# EAGLE design Adafruit-BeagleBone-ProtoBoard-v0.1 (EAGLE 5.12)
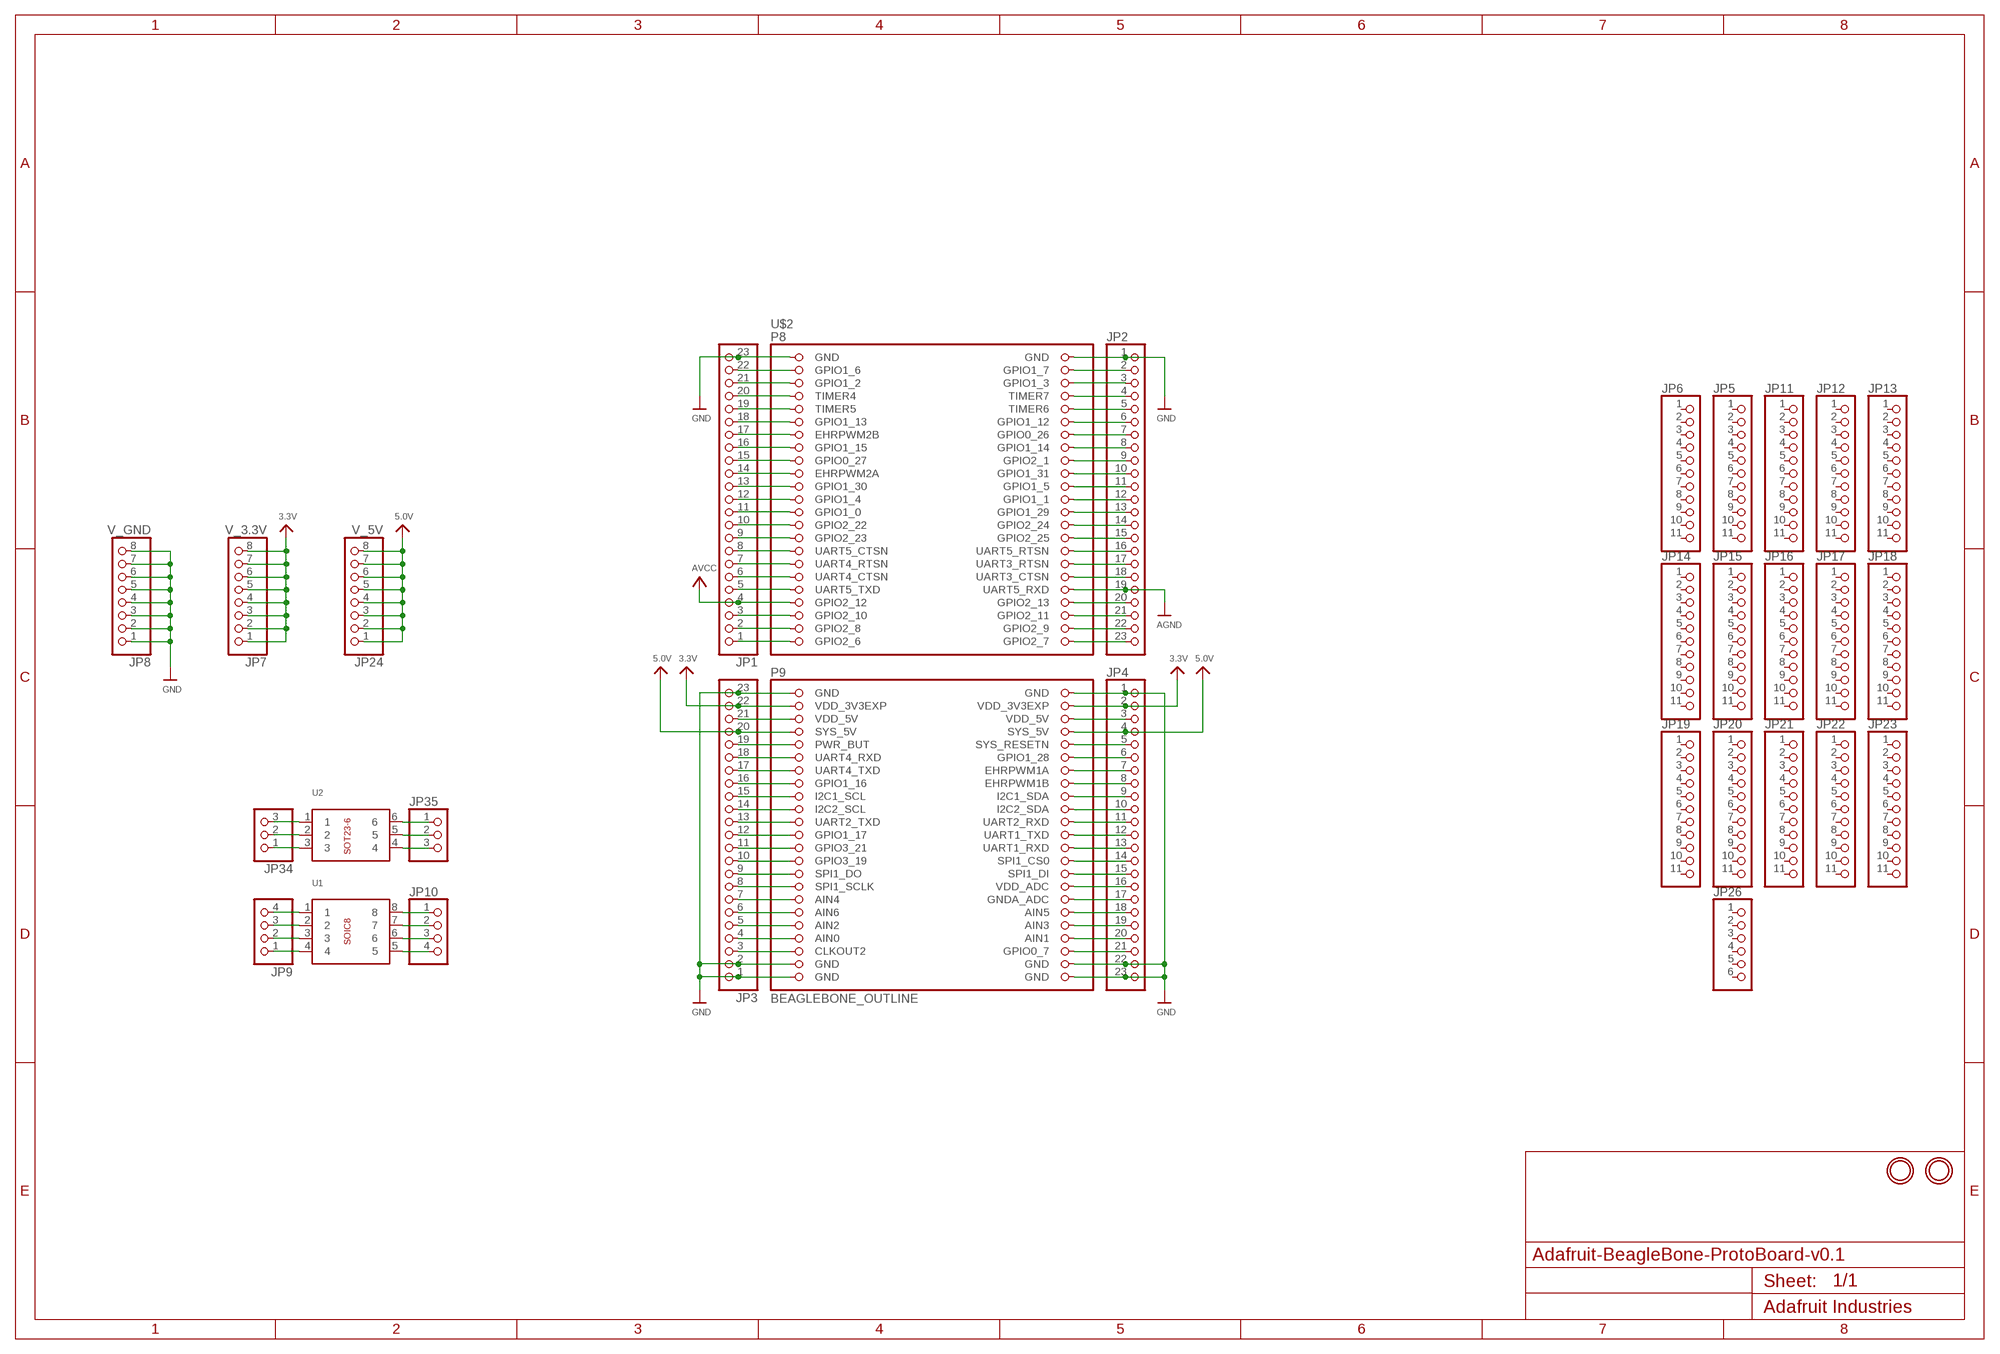
[diagram p0: schematic, sheet 1]

## Parts
JP1  HEADER-1X23  [1X23_ROUND_70MIL]
JP2  HEADER-1X23  [1X23_ROUND_70MIL]
JP3  HEADER-1X23  [1X23_ROUND_70MIL]
JP4  HEADER-1X23  [1X23_ROUND_70MIL]
JP5  HEADER-1X1176MIL  [1X11_ROUND_76]
JP6  HEADER-1X1176MIL  [1X11_ROUND_76]
JP7  V_3.3V  HEADER-1X870MIL  [1X08_ROUND_70]
JP8  V_GND  HEADER-1X870MIL  [1X08_ROUND_70]
JP9  HEADER-1X476MIL  [1X04_ROUND_76]
JP10  HEADER-1X476MIL  [1X04_ROUND_76]
JP11  HEADER-1X1176MIL  [1X11_ROUND_76]
JP12  HEADER-1X1176MIL  [1X11_ROUND_76]
JP13  HEADER-1X1176MIL  [1X11_ROUND_76]
JP14  HEADER-1X1176MIL  [1X11_ROUND_76]
JP15  HEADER-1X1176MIL  [1X11_ROUND_76]
JP16  HEADER-1X1176MIL  [1X11_ROUND_76]
JP17  HEADER-1X1176MIL  [1X11_ROUND_76]
JP18  HEADER-1X1176MIL  [1X11_ROUND_76]
JP19  HEADER-1X1176MIL  [1X11_ROUND_76]
JP20  HEADER-1X1176MIL  [1X11_ROUND_76]
JP21  HEADER-1X1176MIL  [1X11_ROUND_76]
JP22  HEADER-1X1176MIL  [1X11_ROUND_76]
JP23  HEADER-1X1176MIL  [1X11_ROUND_76]
JP24  V_5V  HEADER-1X870MIL  [1X08_ROUND_70]
JP26  HEADER-1X676MIL  [1X06_ROUND_76]
JP34  HEADER-1X376MIL  [1X03_ROUND_76]
JP35  HEADER-1X376MIL  [1X03_ROUND_76]
U1  BREAKOUT_SOIC8  [BREAKOUT_SOIC8]
U2  BREAKOUT_SOT23-6  [BREAKOUT_SOT23-6]
U$2  BEAGLEBONE_OUTLINE  [BEAGLEBONE_SHIELD]
U$22  MOUNTINGHOLE3.0THIN  [MOUNTINGHOLE_3.0_PLATEDTHIN]
U$23  MOUNTINGHOLE3.0THIN  [MOUNTINGHOLE_3.0_PLATEDTHIN]

## Nets
3.3V: JP3.22 JP4.2 JP7.1 JP7.2 JP7.3 JP7.4 JP7.5 JP7.6 JP7.7 JP7.8 U$2.49(VDD_3V3EXP) U$2.50(VDD_3V3EXP)
5.0V: JP3.20 JP4.4 JP24.1 JP24.2 JP24.3 JP24.4 JP24.5 JP24.6 JP24.7 JP24.8 U$2.53(SYS_5V) U$2.54(SYS_5V)
AGND: JP2.19 U$2.38(UART5_RXD)
AVCC: JP1.4 U$2.39(GPIO2_12)
GND: JP1.23 JP2.1 JP3.1 JP3.2 JP3.23 JP4.1 JP4.22 JP4.23 JP8.1 JP8.2 JP8.3 JP8.4 JP8.5 JP8.6 JP8.7 JP8.8 U$2.1(GND) U$2.2(GND) U$2.47(GND) U$2.48(GND) U$2.89(GND) U$2.90(GND) U$2.91(GND) U$2.92(GND)
N$1: JP9.4 U1.1
N$2: JP9.3 U1.2
N$3: JP9.2 U1.3
N$4: JP1.20 U$2.7(TIMER4)
N$5: JP1.19 U$2.9(TIMER5)
N$6: JP1.18 U$2.11(GPIO1_13)
N$7: JP1.17 U$2.13(EHRPWM2B)
N$8: JP1.16 U$2.15(GPIO1_15)
N$9: JP1.15 U$2.17(GPIO0_27)
N$10: JP1.14 U$2.19(EHRPWM2A)
N$11: JP1.13 U$2.21(GPIO1_30)
N$12: JP1.12 U$2.23(GPIO1_4)
N$13: JP1.11 U$2.25(GPIO1_0)
N$14: JP1.10 U$2.27(GPIO2_22)
N$15: JP1.9 U$2.29(GPIO2_23)
N$16: JP1.8 U$2.31(UART5_CTSN)
N$17: JP1.7 U$2.33(UART4_RTSN)
N$18: JP1.6 U$2.35(UART4_CTSN)
N$19: JP1.5 U$2.37(UART5_TXD)
N$20: JP9.1 U1.4
N$21: JP1.3 U$2.41(GPIO2_10)
N$22: JP1.2 U$2.43(GPIO2_8)
N$23: JP1.1 U$2.45(GPIO2_6)
N$24: JP10.1 U1.8
N$25: JP10.2 U1.7
N$26: JP10.3 U1.6
N$27: JP2.4 U$2.8(TIMER7)
N$28: JP2.5 U$2.10(TIMER6)
N$29: JP2.6 U$2.12(GPIO1_12)
N$30: JP2.7 U$2.14(GPIO0_26)
N$31: JP2.8 U$2.16(GPIO1_14)
N$32: JP2.9 U$2.18(GPIO2_1)
N$33: JP2.10 U$2.20(GPIO1_31)
N$34: JP2.11 U$2.22(GPIO1_5)
N$35: JP2.12 U$2.24(GPIO1_1)
N$36: JP2.13 U$2.26(GPIO1_29)
N$37: JP2.14 U$2.28(GPIO2_24)
N$38: JP2.15 U$2.30(GPIO2_25)
N$39: JP2.16 U$2.32(UART5_RTSN)
N$40: JP2.17 U$2.34(UART3_RTSN)
N$41: JP2.18 U$2.36(UART3_CTSN)
N$42: JP10.4 U1.5
N$43: JP2.20 U$2.40(GPIO2_13)
N$44: JP2.21 U$2.42(GPIO2_11)
N$45: JP2.22 U$2.44(GPIO2_9)
N$46: JP2.23 U$2.46(GPIO2_7)
N$47: JP1.22 U$2.3(GPIO1_6)
N$48: JP1.21 U$2.5(GPIO1_2)
N$49: JP3.21 U$2.51(VDD_5V)
N$50: JP2.2 U$2.4(GPIO1_7)
N$51: JP3.19 U$2.55(PWR_BUT)
N$52: JP3.18 U$2.57(UART4_RXD)
N$53: JP3.17 U$2.59(UART4_TXD)
N$54: JP3.16 U$2.61(GPIO1_16)
N$55: JP3.15 U$2.63(I2C1_SCL)
N$56: JP3.14 U$2.65(I2C2_SCL)
N$57: JP3.13 U$2.67(UART2_TXD)
N$58: JP3.12 U$2.69(GPIO1_17)
N$59: JP3.11 U$2.71(GPIO3_21)
N$60: JP3.10 U$2.73(GPIO3_19)
N$61: JP3.9 U$2.75(SPI1_DO)
N$62: JP3.8 U$2.77(SPI1_SCLK)
N$63: JP3.7 U$2.79(AIN4)
N$64: JP3.6 U$2.81(AIN6)
N$65: JP3.5 U$2.83(AIN2)
N$66: JP3.4 U$2.85(AIN0)
N$67: JP3.3 U$2.87(CLKOUT2)
N$68: JP2.3 U$2.6(GPIO1_3)
N$69: JP4.21 U$2.88(GPIO0_7)
N$72: JP4.3 U$2.52(VDD_5V)
N$74: JP4.5 U$2.56(SYS_RESETN)
N$75: JP4.6 U$2.58(GPIO1_28)
N$76: JP4.7 U$2.60(EHRPWM1A)
N$77: JP4.8 U$2.62(EHRPWM1B)
N$78: JP4.9 U$2.64(I2C1_SDA)
N$79: JP4.10 U$2.66(I2C2_SDA)
N$80: JP4.11 U$2.68(UART2_RXD)
N$81: JP4.12 U$2.70(UART1_TXD)
N$82: JP4.13 U$2.72(UART1_RXD)
N$83: JP4.14 U$2.74(SPI1_CS0)
N$84: JP4.15 U$2.76(SPI1_DI)
N$85: JP4.16 U$2.78(VDD_ADC)
N$86: JP4.17 U$2.80(GNDA_ADC)
N$87: JP4.18 U$2.82(AIN5)
N$88: JP4.19 U$2.84(AIN3)
N$89: JP4.20 U$2.86(AIN1)
N$100: JP34.3 U2.1
N$101: JP34.2 U2.2
N$102: JP34.1 U2.3
N$103: JP35.1 U2.6
N$104: JP35.2 U2.5
N$105: JP35.3 U2.4
Unconnected: JP5.1 JP5.2 JP5.3 JP5.4 JP5.5 JP5.6 JP5.7 JP5.8 JP5.9 JP5.10 JP5.11 JP6.1 JP6.2 JP6.3 JP6.4 JP6.5 JP6.6 JP6.7 JP6.8 JP6.9 JP6.10 JP6.11 JP11.1 JP11.2 JP11.3 JP11.4 JP11.5 JP11.6 JP11.7 JP11.8 JP11.9 JP11.10 JP11.11 JP12.1 JP12.2 JP12.3 JP12.4 JP12.5 JP12.6 JP12.7 JP12.8 JP12.9 JP12.10 JP12.11 JP13.1 JP13.2 JP13.3 JP13.4 JP13.5 JP13.6 JP13.7 JP13.8 JP13.9 JP13.10 JP13.11 JP14.1 JP14.2 JP14.3 JP14.4 JP14.5 JP14.6 JP14.7 JP14.8 JP14.9 JP14.10 JP14.11 JP15.1 JP15.2 JP15.3 JP15.4 JP15.5 JP15.6 JP15.7 JP15.8 JP15.9 JP15.10 JP15.11 JP16.1 JP16.2 JP16.3 JP16.4 JP16.5 JP16.6 JP16.7 JP16.8 JP16.9 JP16.10 JP16.11 JP17.1 JP17.2 JP17.3 JP17.4 JP17.5 JP17.6 JP17.7 JP17.8 JP17.9 JP17.10 JP17.11 JP18.1 JP18.2 JP18.3 JP18.4 JP18.5 JP18.6 JP18.7 JP18.8 JP18.9 JP18.10 JP18.11 JP19.1 JP19.2 JP19.3 JP19.4 JP19.5 JP19.6 JP19.7 JP19.8 JP19.9 JP19.10 JP19.11 JP20.1 JP20.2 JP20.3 JP20.4 JP20.5 JP20.6 JP20.7 JP20.8 JP20.9 JP20.10 JP20.11 JP21.1 JP21.2 JP21.3 JP21.4 JP21.5 JP21.6 JP21.7 JP21.8 JP21.9 JP21.10 JP21.11 JP22.1 JP22.2 JP22.3 JP22.4 JP22.5 JP22.6 JP22.7 JP22.8 JP22.9 JP22.10 JP22.11 JP23.1 JP23.2 JP23.3 JP23.4 JP23.5 JP23.6 JP23.7 JP23.8 JP23.9 JP23.10 JP23.11 JP26.1 JP26.2 JP26.3 JP26.4 JP26.5 JP26.6

## Library data of the parts
JP1-JP4 = microbuilder:HEADER-1X23
JP5 JP6 JP11-JP23 = microbuilder:HEADER-1X11
JP7 JP8 JP24 = microbuilder:HEADER-1X8: PIN HEADER
JP9 JP10 = microbuilder:HEADER-1X4: PIN HEADER
JP26 = microbuilder:HEADER-1X6: PIN HEADER
JP34 JP35 = microbuilder:HEADER-1X3: PIN HEADER
U1 = microbuilder:BREAKOUT_SOIC8: SOIC8 IC Breakout
U2 = microbuilder:BREAKOUT_SOT23-6: IC Breakout SOT23-6
U$2 = microbuilder:BEAGLEBONE_OUTLINE
U$22 U$23 = microbuilder:MOUNTINGHOLE: Mounting Hole

## Board
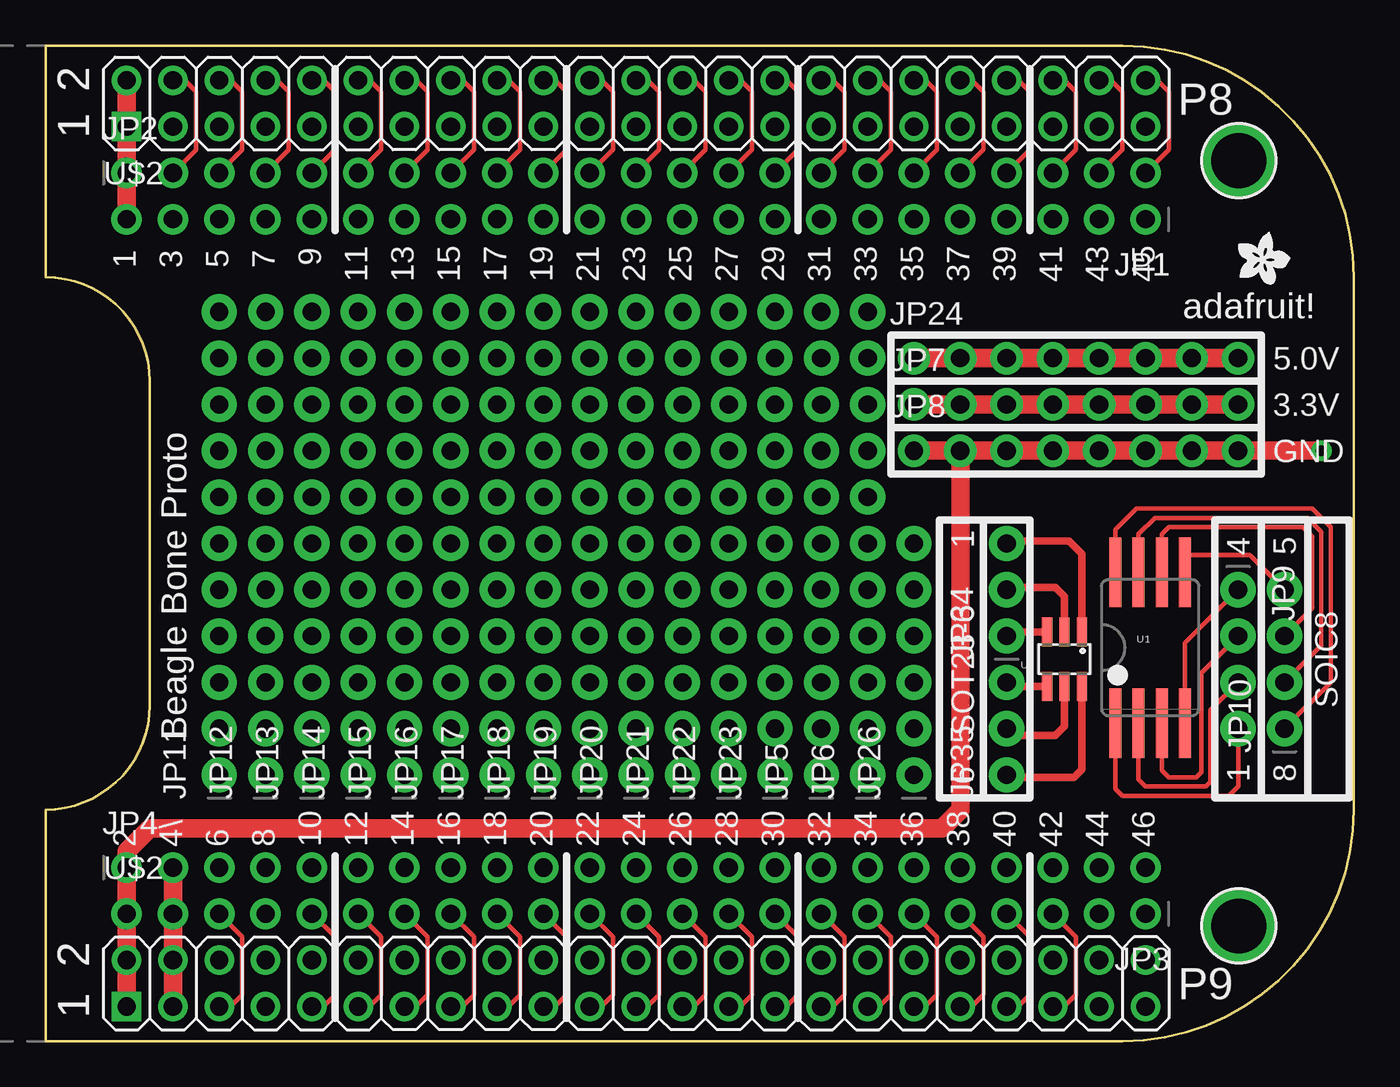
[diagram p1: board, top side]
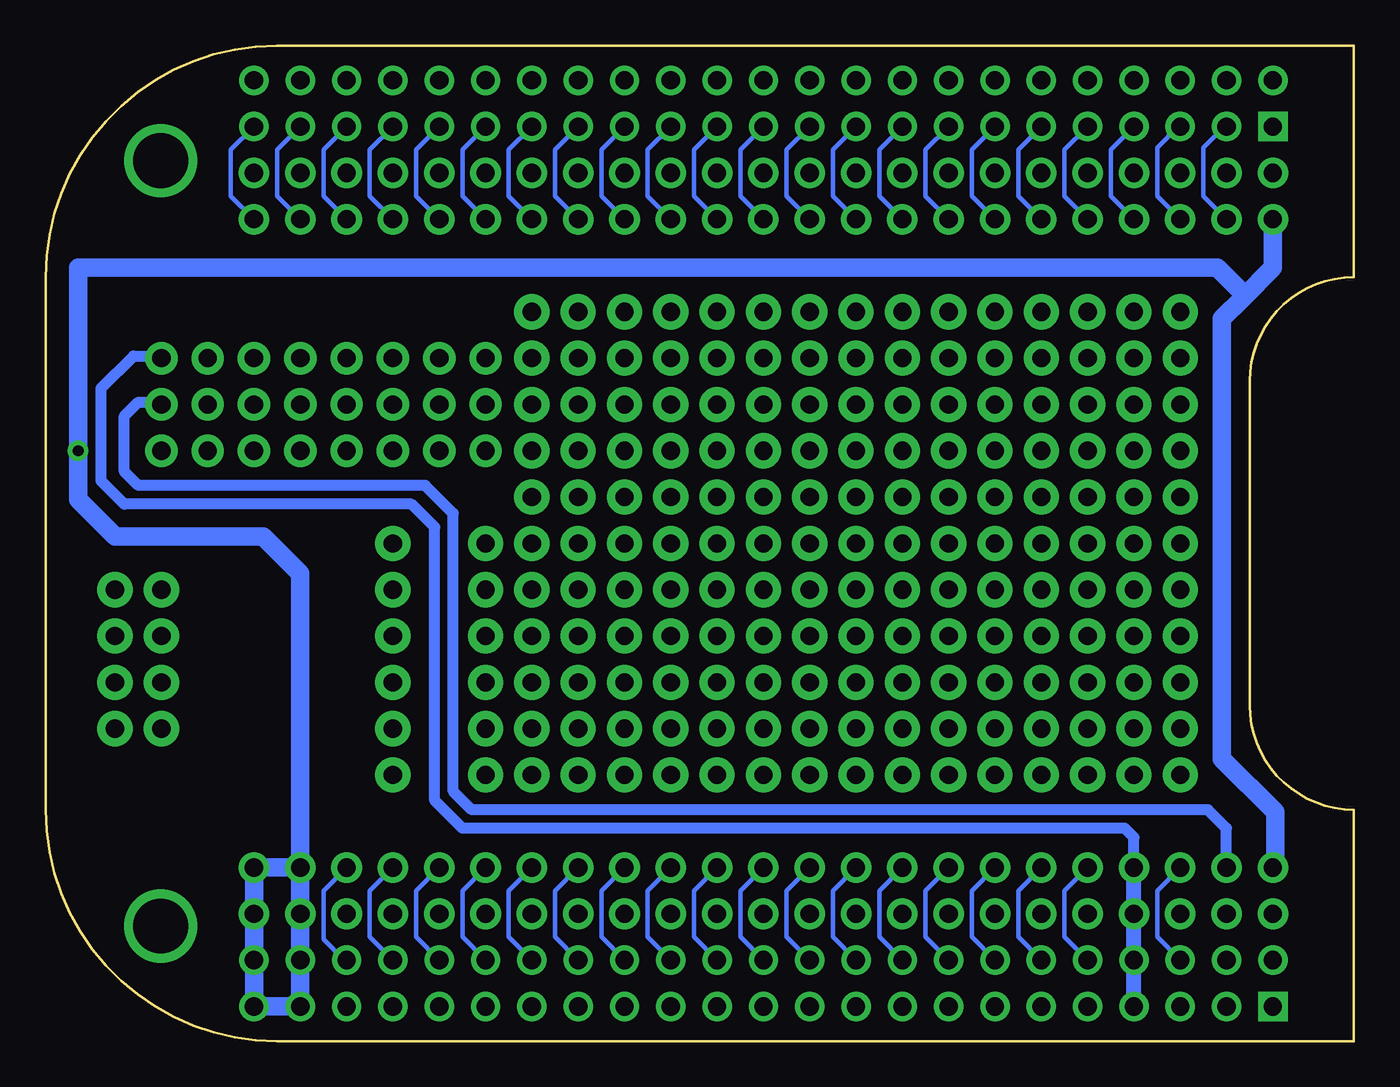
[diagram p2: board, bottom side, seen from below]

Size 71.75 x 54.61 mm. Coordinates in mm from the lower left corner, seen from the top.
Copper layers (1*16): Top 0.035mm / dielectric 1.5mm / Bottom 0.035mm
Design rules "SparkFun10mil": minimum track width 10mil, minimum drill 20mil, track to track 10mil, track to pad 10mil, pad to pad 10mil, via to via 10mil, smd to smd 10mil, copper to edge 10mil, drill to drill 10mil, minimum pad ring 12mil, minimum via ring 10mil, stop-mask expansion 4mil, vias tented up to drill 25mil, thermal gap 10mil

### Footprints (pad centres in the part's own frame; a part is rotated, then mirrored left to right if it is on the bottom)
1X23_ROUND_70MIL = drill 1 pad 1.676 round: 1 -27.94,0; 2 -25.4,0; 3 -22.86,0; 4 -20.32,0; 5 -17.78,0; 6 -15.24,0; 7 -12.7,0; 8 -10.16,0; 9 -7.62,0; 10 -5.08,0; 11 -2.54,0; 12 0,0; 13 2.54,0; 14 5.08,0; 15 7.62,0; 16 10.16,0; 17 12.7,0; 18 15.24,0; 19 17.78,0; 20 20.32,0; 21 22.86,0; 22 25.4,0; 23 27.94,0
1X11_ROUND_76 = drill 1 pad 1.93 round: 1 -12.7,0; 2 -10.16,0; 3 -7.62,0; 4 -5.08,0; 5 -2.54,0; 6 0,0; 7 2.54,0; 8 5.08,0; 9 7.62,0; 10 10.16,0; 11 12.7,0
1X08_ROUND_70 = drill 1 pad 1.778 round: 1 -8.89,0; 2 -6.35,0; 3 -3.81,0; 4 -1.27,0; 5 1.27,0; 6 3.81,0; 7 6.35,0; 8 8.89,0
1X04_ROUND_76 = drill 1 pad 1.93 round: 1 -3.81,0; 2 -1.27,0; 3 1.27,0; 4 3.81,0
1X06_ROUND_76 = drill 1 pad 1.93 round: 1 -6.35,0; 2 -3.81,0; 3 -1.27,0; 4 1.27,0; 5 3.81,0; 6 6.35,0
1X03_ROUND_76 = drill 1 pad 1.93 round: 1 -2.54,0; 2 0,0; 3 2.54,0
BREAKOUT_SOIC8 = smd 0.66 x 3.81: 1 -1.905,-4.14; 2 -0.635,-4.14; 3 0.635,-4.14; 4 1.905,-4.14; 5 1.905,4.14; 6 0.635,4.14; 7 -0.635,4.14; 8 -1.905,4.14
BREAKOUT_SOT23-6 = smd 0.55 x 1.6: 1 -0.95,-1.5; 2 0,-1.5; 3 0.95,-1.5; 4 0.95,1.5; 5 0,1.5; 6 -0.95,1.5
BEAGLEBONE_SHIELD = drill 1 square: 1 4.445,19.05; 47 52.705,19.05 | drill 1 round: 2 1.905,19.05; 3 4.445,21.59; 4 1.905,21.59; 5 4.445,24.13; 6 1.905,24.13; 7 4.445,26.67; 8 1.905,26.67; 9 4.445,29.21; 10 1.905,29.21; 11 4.445,31.75; 12 1.905,31.75; 13 4.445,34.29; 14 1.905,34.29; 15 4.445,36.83; 16 1.905,36.83; 17 4.445,39.37; 18 1.905,39.37; 19 4.445,41.91; 20 1.905,41.91; 21 4.445,44.45; 22 1.905,44.45; 23 4.445,46.99; 24 1.905,46.99; 25 4.445,49.53; 26 1.905,49.53; 27 4.445,52.07; 28 1.905,52.07; 29 4.445,54.61; 30 1.905,54.61; 31 4.445,57.15; 32 1.905,57.15; 33 4.445,59.69; 34 1.905,59.69; 35 4.445,62.23; 36 1.905,62.23; 37 4.445,64.77; 38 1.905,64.77; 39 4.445,67.31; 40 1.905,67.31; 41 4.445,69.85; 42 1.905,69.85; 43 4.445,72.39; 44 1.905,72.39; 45 4.445,74.93; 46 1.905,74.93; 48 50.165,19.05; 49 52.705,21.59; 50 50.165,21.59; 51 52.705,24.13; 52 50.165,24.13; 53 52.705,26.67; 54 50.165,26.67; 55 52.705,29.21; 56 50.165,29.21; 57 52.705,31.75; 58 50.165,31.75; 59 52.705,34.29; 60 50.165,34.29; 61 52.705,36.83; 62 50.165,36.83; 63 52.705,39.37; 64 50.165,39.37; 65 52.705,41.91; 66 50.165,41.91; 67 52.705,44.45; 68 50.165,44.45; 69 52.705,46.99; 70 50.165,46.99; 71 52.705,49.53; 72 50.165,49.53; 73 52.705,52.07; 74 50.165,52.07; 75 52.705,54.61; 76 50.165,54.61; 77 52.705,57.15; 78 50.165,57.15; 79 52.705,59.69; 80 50.165,59.69; 81 52.705,62.23; 82 50.165,62.23; 83 52.705,64.77; 84 50.165,64.77; 85 52.705,67.31; 86 50.165,67.31; 87 52.705,69.85; 88 50.165,69.85; 89 52.705,72.39; 90 50.165,72.39; 91 52.705,74.93; 92 50.165,74.93
MOUNTINGHOLE_3.0_PLATEDTHIN = drill 3 pad 3.6 round: P$1 0,0

### Placement (x,y rotation side)
JP1  32.39,45.09 180 top
JP2  32.39,47.62 0 top
JP3  32.39,6.99 180 top
JP4  32.39,9.53 0 top
JP5  42.55,27.3 90 top
JP6  45.08,27.3 90 top
JP7  56.52,34.92 0 top
JP8  56.52,32.38 0 top
JP9  65.41,20.95 270 top
JP10  67.94,20.95 90 top
JP11  9.52,27.3 90 top
JP12  12.07,27.3 90 top
JP13  14.61,27.3 90 top
JP14  17.14,27.3 90 top
JP15  19.68,27.3 90 top
JP16  22.22,27.3 90 top
JP17  24.76,27.3 90 top
JP18  27.3,27.3 90 top
JP19  29.85,27.3 90 top
JP20  32.39,27.3 90 top
JP21  34.92,27.3 90 top
JP22  37.47,27.3 90 top
JP23  40,27.3 90 top
JP24  56.52,37.47 0 top
JP26  47.62,20.95 90 top
JP34  52.7,24.77 90 top
JP35  52.7,17.14 90 top
U1  60.58,21.59 0 top
U2  55.88,20.95 180 top
U$2  -14.61,54.61 270 top
U$7  [ADAFRUIT200MIL]  66.8,43.05 270 top
U$22  65.44,48.3 0 top
U$23  65.44,6.32 0 top

### Tracks (layer width: path | path; a pad name or v marks a point on that pad's centre or on a via)
3.3V
  Top 1.016: JP7.8 JP7.7 JP7.6 JP7.5 JP7.4 JP7.3 JP7.2 JP7.1 | U$2.49 U$2.50 JP3.22 JP4.2
  Bottom 0.61: JP4.2 6.98,11.68 8,12.7 48.39,12.7 49.4,13.72 49.4,28.96 50.93,30.48 66.67,30.48 67.44,31.24 67.44,34.29 66.67,35.05 65.53,35.05 JP7.8
5.0V
  Top 1.016: JP24.1 JP24.2 JP24.3 JP24.4 JP24.5 JP24.6 JP24.7 JP24.8
  Bottom 0.61: JP4.4 12.07,11.18 12.57,11.68 48.89,11.68 50.42,13.21 50.42,28.19 51.69,29.46 67.44,29.46 68.71,30.73 68.71,35.81 66.93,37.59 65.53,37.59 JP24.8
  Bottom 0.813: U$2.53 U$2.54 JP3.20 JP4.4
AGND
  Top 0.254: U$2.38 50.8,52.7 51.44,52.07 51.44,48.9 JP2.19
AVCC
  Bottom 0.254: U$2.39 53.97,48.9 53.97,46.35 JP1.4
GND  (via drill 0.6)
  Top 1.016: JP8.1 JP8.2 JP8.3 JP8.4 JP8.5 JP8.6 JP8.7 JP8.8 v69.98,32.38 | U$2.47 U$2.48 JP3.23 JP4.1 4.45,10.41 5.71,11.68 49.15,11.68 50.16,12.7 50.16,32.51 | U$2.2 U$2.1 JP2.1 JP1.23
  Bottom 1.016: JP4.1 4.32,9.65 4.32,12.57 7.24,15.49 7.24,39.62 6.1,40.77 | JP4.22 JP3.2 U$2.90 U$2.89 U$2.91 U$2.92 JP3.1 JP4.23 JP4.22 | JP1.23 4.45,42.42 6.1,40.77 | 6.1,40.77 6.1,41.02 7.49,42.42 69.98,42.42 v69.98,32.38 69.98,29.72 67.94,27.69 59.82,27.69 57.78,25.65 JP4.22 | JP8.1 47.5,32.26
N$1
  Top 0.254: U1.1 58.67,13.84 59.05,13.46 64.9,13.46 65.41,13.97 JP9.4
N$2
  Top 0.254: U1.2 59.94,14.35 60.33,13.97 63.63,13.97 63.88,14.22 63.88,18.16 JP9.3
N$3
  Top 0.254: U1.3 61.21,14.86 61.59,14.48 63.12,14.48 63.37,14.73 63.37,20.19 JP9.2
N$4
  Bottom 0.254: U$2.7 13.34,48.9 13.34,46.35 JP1.20
N$5
  Bottom 0.254: U$2.9 15.88,48.9 15.88,46.35 JP1.19
N$6
  Bottom 0.254: U$2.11 18.42,48.9 18.42,46.35 JP1.18
N$7
  Bottom 0.254: U$2.13 20.96,48.9 20.96,46.35 JP1.17
N$8
  Bottom 0.254: U$2.15 23.5,48.9 23.5,46.35 JP1.16
N$9
  Bottom 0.254: U$2.17 26.04,48.9 26.04,46.35 JP1.15
N$10
  Bottom 0.254: U$2.19 28.57,48.9 28.57,46.35 JP1.14
N$11
  Bottom 0.254: U$2.21 31.11,48.9 31.11,46.35 JP1.13
N$12
  Bottom 0.254: U$2.23 33.66,48.9 33.66,46.35 JP1.12
N$13
  Bottom 0.254: U$2.25 36.19,48.9 36.19,46.35 JP1.11
N$14
  Bottom 0.254: U$2.27 38.73,48.9 38.73,46.35 JP1.10
N$15
  Bottom 0.254: U$2.29 41.28,48.9 41.28,46.35 JP1.9
N$16
  Bottom 0.254: U$2.31 43.81,48.9 43.81,46.35 JP1.8
N$17
  Bottom 0.254: U$2.33 46.36,48.9 46.36,46.35 JP1.7
N$18
  Bottom 0.254: U$2.35 48.89,48.9 48.89,46.35 JP1.6
N$19
  Bottom 0.254: U$2.37 51.44,48.9 51.44,46.35 JP1.5
N$20
  Top 0.254: U1.4 62.48,21.84 JP9.1
N$21
  Bottom 0.254: U$2.41 56.52,48.9 56.52,46.35 JP1.3
N$22
  Bottom 0.254: U$2.43 59.05,48.9 59.05,46.35 JP1.2
N$23
  Bottom 0.254: U$2.45 61.59,48.9 61.59,46.35 JP1.1
N$24
  Top 0.254: U1.8 58.67,28.07 59.82,29.21 69.47,29.21 70.48,28.19 70.48,19.68 JP10.1
N$25
  Top 0.254: U1.7 59.94,27.81 60.83,28.7 69.21,28.7 69.98,27.94 69.98,21.72 JP10.2
N$26
  Top 0.254: U1.6 61.21,27.81 61.59,28.19 68.96,28.19 69.47,27.69 69.47,23.75 JP10.3
N$27
  Top 0.254: U$2.8 12.7,52.7 13.34,52.07 13.34,48.9 JP2.4
N$28
  Top 0.254: U$2.10 15.24,52.7 15.88,52.07 15.88,48.9 JP2.5
N$29
  Top 0.254: U$2.12 17.78,52.7 18.42,52.07 18.42,48.9 JP2.6
N$30
  Top 0.254: U$2.14 20.32,52.7 20.96,52.07 20.96,48.9 JP2.7
N$31
  Top 0.254: U$2.16 22.86,52.7 23.5,52.07 23.5,48.9 JP2.8
N$32
  Top 0.254: U$2.18 25.4,52.7 26.04,52.07 26.04,48.9 JP2.9
N$33
  Top 0.254: U$2.20 27.94,52.7 28.57,52.07 28.57,48.9 JP2.10
N$34
  Top 0.254: U$2.22 30.48,52.7 31.11,52.07 31.11,48.9 JP2.11
N$35
  Top 0.254: U$2.24 33.02,52.7 33.66,52.07 33.66,48.9 JP2.12
N$36
  Top 0.254: U$2.26 35.56,52.7 36.19,52.07 36.19,48.9 JP2.13
N$37
  Top 0.254: U$2.28 38.1,52.7 38.73,52.07 38.73,48.9 JP2.14
N$38
  Top 0.254: U$2.30 40.64,52.7 41.28,52.07 41.28,48.9 JP2.15
N$39
  Top 0.254: U$2.32 43.18,52.7 43.81,52.07 43.81,48.9 JP2.16
N$40
  Top 0.254: U$2.34 45.72,52.7 46.36,52.07 46.36,48.9 JP2.17
N$41
  Top 0.254: U$2.36 48.26,52.7 48.89,52.07 48.89,48.9 JP2.18
N$42
  Top 0.254: U1.5 62.48,26.54 62.61,26.67 66.04,26.67 JP10.4
N$43
  Top 0.254: U$2.40 53.34,52.7 53.97,52.07 53.97,48.9 JP2.20
N$44
  Top 0.254: U$2.42 55.88,52.7 56.52,52.07 56.52,48.9 JP2.21
N$45
  Top 0.254: U$2.44 58.42,52.7 59.05,52.07 59.05,48.9 JP2.22
N$46
  Top 0.254: U$2.46 60.96,52.7 61.59,52.07 61.59,48.9 JP2.23
N$47
  Bottom 0.254: U$2.3 7.11,50.16 8.25,49.02 8.25,46.35 JP1.22
N$48
  Bottom 0.254: U$2.5 9.65,50.16 10.79,49.02 10.79,46.35 JP1.21
N$49
  Top 0.254: U$2.51 10.16,1.91 10.79,2.54 10.79,5.71 JP3.21
N$50
  Top 0.254: U$2.4 7.62,52.7 8.25,52.07 8.25,48.9 JP2.2
N$51
  Top 0.254: U$2.55 15.24,1.91 15.88,2.54 15.88,5.71 JP3.19
N$52
  Top 0.254: U$2.57 17.78,1.91 18.42,2.54 18.42,5.71 JP3.18
N$53
  Top 0.254: U$2.59 20.32,1.91 20.96,2.54 20.96,5.71 JP3.17
N$54
  Top 0.254: U$2.61 22.86,1.91 23.5,2.54 23.5,5.71 JP3.16
N$55
  Top 0.254: U$2.63 25.4,1.91 26.04,2.54 26.04,5.71 JP3.15
N$56
  Top 0.254: U$2.65 27.94,1.91 28.57,2.54 28.57,5.71 JP3.14
N$57
  Top 0.254: U$2.67 30.48,1.91 31.11,2.54 31.11,5.71 JP3.13
N$58
  Top 0.254: U$2.69 33.02,1.91 33.66,2.54 33.66,5.71 JP3.12
N$59
  Top 0.254: U$2.71 35.56,1.91 36.19,2.54 36.19,5.71 JP3.11
N$60
  Top 0.254: U$2.73 38.1,1.91 38.73,2.54 38.73,5.71 JP3.10
N$61
  Top 0.254: U$2.75 40.64,1.91 41.28,2.54 41.28,5.71 JP3.9
N$62
  Top 0.254: U$2.77 43.18,1.91 43.81,2.54 43.81,5.71 JP3.8
N$63
  Top 0.254: U$2.79 45.72,1.91 46.36,2.54 46.36,5.71 JP3.7
N$64
  Top 0.254: U$2.81 48.26,1.91 48.89,2.54 48.89,5.71 JP3.6
N$65
  Top 0.254: U$2.83 50.8,1.91 51.44,2.54 51.44,5.71 JP3.5
N$66
  Top 0.254: U$2.85 53.34,1.91 53.97,2.54 53.97,5.71 JP3.4
N$67
  Top 0.254: U$2.87 55.88,1.91 56.52,2.54 56.52,5.71 JP3.3
N$68
  Top 0.254: U$2.6 10.16,52.7 10.79,52.07 10.79,48.9 JP2.3
N$69
  Bottom 0.254: U$2.88 55.37,4.45 56.52,5.59 56.52,8.26 JP4.21
N$72
  Bottom 0.254: JP4.3 10.79,8.26 10.79,5.71 U$2.52
N$74
  Bottom 0.254: JP4.5 15.88,8.26 15.88,5.71 U$2.56
N$75
  Bottom 0.254: JP4.6 18.42,8.26 18.42,5.71 U$2.58
N$76
  Bottom 0.254: JP4.7 20.96,8.26 20.96,5.71 U$2.60
N$77
  Bottom 0.254: JP4.8 23.5,8.26 23.5,5.71 U$2.62
N$78
  Bottom 0.254: JP4.9 26.04,8.26 26.04,5.71 U$2.64
N$79
  Bottom 0.254: JP4.10 28.57,8.26 28.57,5.71 U$2.66
N$80
  Bottom 0.254: JP4.11 31.11,8.26 31.11,5.71 U$2.68
N$81
  Bottom 0.254: JP4.12 33.66,8.26 33.66,5.71 U$2.70
N$82
  Bottom 0.254: JP4.13 36.19,8.26 36.19,5.71 U$2.72
N$83
  Bottom 0.254: JP4.14 38.73,8.26 38.73,5.71 U$2.74
N$84
  Bottom 0.254: JP4.15 41.28,8.26 41.28,5.71 U$2.76
N$85
  Bottom 0.254: JP4.16 43.81,8.26 43.81,5.71 U$2.78
N$86
  Bottom 0.254: JP4.17 46.36,8.26 46.36,5.71 U$2.80
N$87
  Bottom 0.254: JP4.18 48.89,8.26 48.89,5.71 U$2.82
N$88
  Bottom 0.254: JP4.19 51.44,8.26 51.44,5.71 U$2.84
N$89
  Bottom 0.254: JP4.20 53.97,8.26 53.97,5.71 U$2.86
N$100
  Top 0.406: U2.1 56.83,26.74 56.13,27.43 52.83,27.43 JP34.3
N$101
  Top 0.406: U2.2 55.88,24.38 55.37,24.89 52.83,24.89 JP34.2
N$102
  Top 0.406: U2.3 52.94,22.45 JP34.1
N$103
  Top 0.406: U2.6 56.83,14.92 56.39,14.48 52.83,14.48 JP35.1
N$104
  Top 0.406: U2.5 55.88,17.27 55.37,16.76 53.09,16.76 JP35.2
N$105
  Top 0.406: U2.4 52.94,19.45 JP35.3

### Text on the board
tPlace: 2 | P8 | 1 | 9 | 1 | 3 | 5 | 7 | 11 | 13 | 15 | 17 | 19 | 21 | 23 | 25 | 27 | 29 | 31 | 33 | 35 | 37 | 39 | 41 | 43 | 45 | adafruit! | 5.0V | 3.3V | GND | 1 | 4 | 5 | SOIC8 | Beagle Bone Proto | SOT23-6 | 6 | 1 | 8 | 2 | 4\ | 6 | 8 | 10 | 12 | 14 | 16 | 18 | 20 | 22 | 24 | 26 | 28 | 30 | 32 | 34 | 36 | 38 | 40 | 42 | 44 | 46 | 2 | P9 | 1